# Altium schematic sheet ANTENNE.SchDoc: Antenne
size A4; Revision: v1.0; SheetNumber: 3; SheetTotal: 8
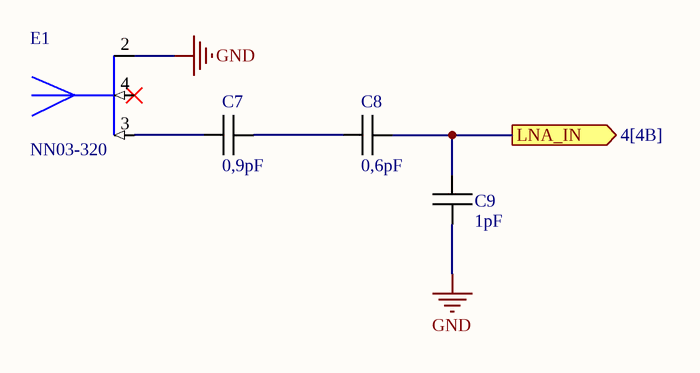
[diagram p0: ANTENNE.SchDoc]

## Parts
C7  0,9pF  [CAPC1005X06N]
C8  0,6pF  [CAPC1005X06N]
C9  1pF  [CAPC1005X06N]
E1  NN03-320  [XCVR_NN03-320]

## Ports
LNA_IN (out, see 4[4B])

## Nets
GND: C9.1 E1.2(GROUND)
LNA_IN: C8.2 C9.2 ; port LNA_IN
NetC7_1: C7.1 E1.3(FEED_BLUETOOTH)
NetC7_2: C7.2 C8.1

Not connected (* = marked no-connect by the designer): E1 4(FEED_GNSS)*

## Library data of the parts
C7-C9 = Capacitor
E1 = NN03-320: Dual port antenna booster for GNSS, Bluetooth, 5G and UWB (1561 - 1606MHz, 2400 - 2500MHz, 3400 - 3800MHz, 3100 - 4800MHz and 6000 - 10600 MHz), signal booster; Manufacturer_Name: Ignion; Manufacturer_Part_Number: NN03-320; Mouser Part Number: 128-NN03-320